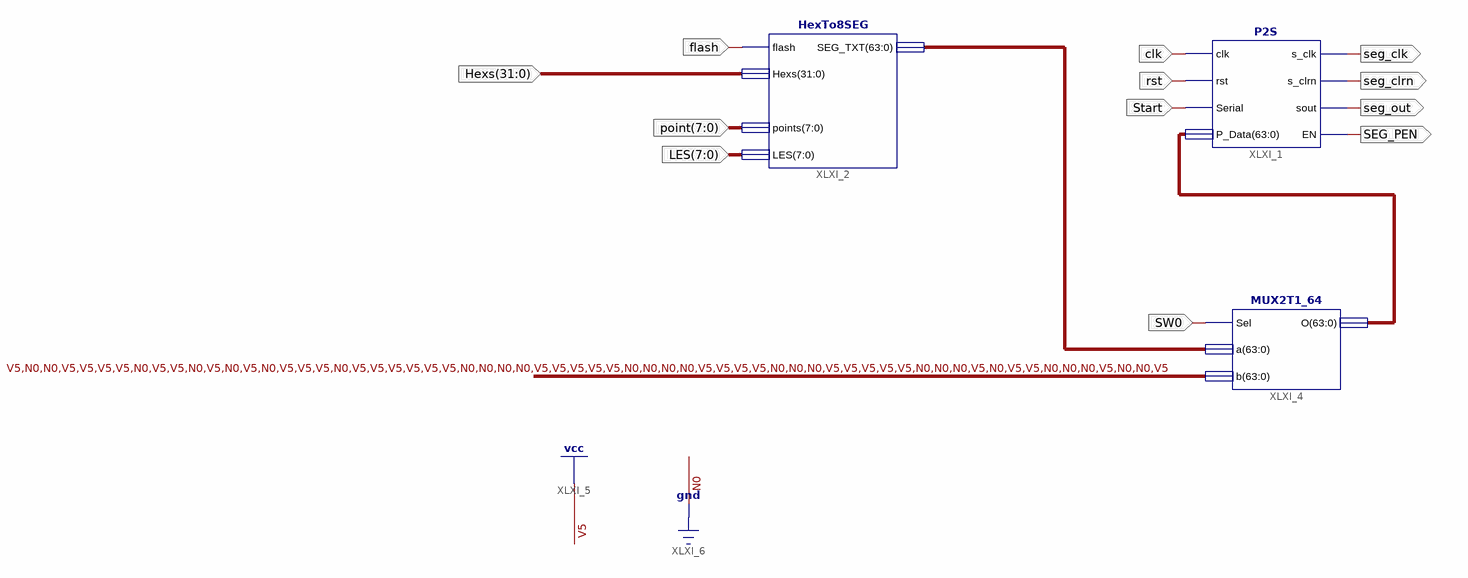
[diagram p0: schematic sheet 1]
// Xilinx ISE schematic Display.sch (kintex7) as structural Verilog: 3 symbols, 12 ports
module Display (
  input  clk,
  input  rst,
  input  Start,
  input  SW0,
  input  [31:0] Hexs,
  input  flash,
  input  [7:0] point,
  input  [7:0] LES,
  output seg_clk,
  output seg_clrn,
  output seg_out,
  output SEG_PEN
);

  wire [63:0] XLXN_5, XLXN_13;

  P2S XLXI_1 (
    .clk(clk), .rst(rst), .Serial(Start), .P_Data(XLXN_13), .s_clk(seg_clk), .s_clrn(seg_clrn),
    .sout(seg_out), .EN(SEG_PEN));
  HexTo8SEG XLXI_2 (.flash(flash), .Hexs(Hexs), .points(point), .LES(LES), .SEG_TXT(XLXN_5));
  MUX2T1_64 XLXI_4 (
    .Sel(SW0), .a(XLXN_5), .b(64'b1001111011010101110111111000011111000011110001111100010110001001),
    .O(XLXN_13));
endmodule
